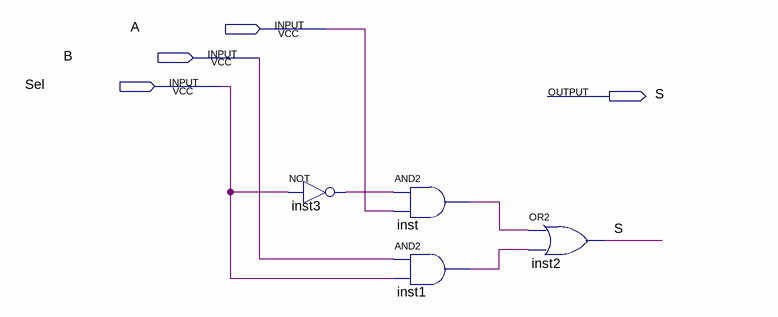
[diagram p0: schematic sheet]
// Quartus schematic mux2x1.bdf as structural Verilog: 4 symbols, 4 pins
module mux2x1 (
  input  A,
  input  B,
  input  Sel,
  output S
);

  wire inst1_out, inst3_out, inst_out;

  not inst3 (inst3_out, Sel);
  and inst (inst_out, inst3_out, A);
  and inst1 (inst1_out, B, Sel);
  or inst2 (S, inst_out, inst1_out);
endmodule
